# EAGLE design acmon_interface (EAGLE 7.2.0)
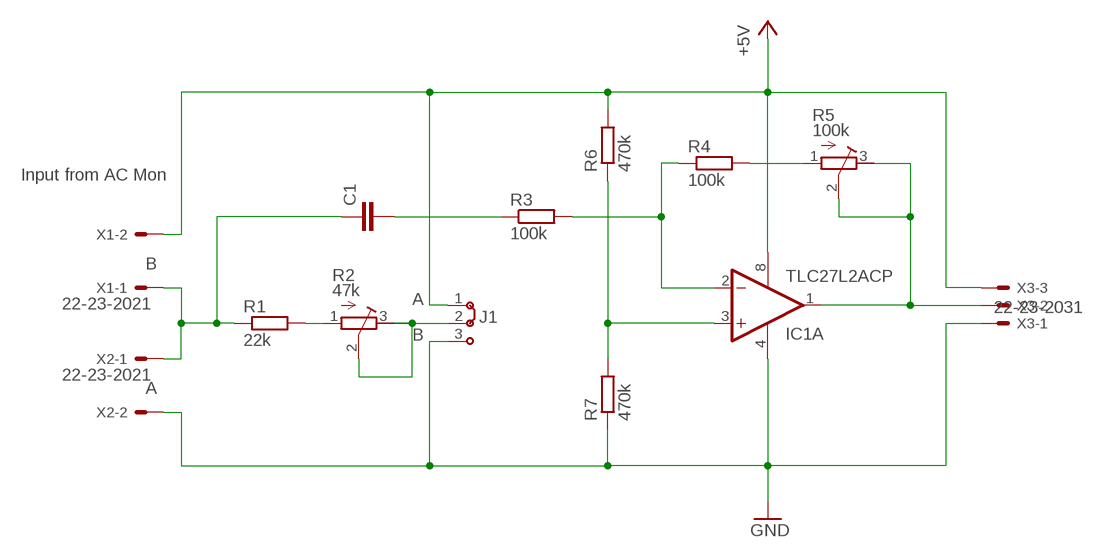
[diagram p0: schematic, sheet 1]

## Parts
C1  C-EU050-030X075  [C050-030X075]
IC1  TLC27L2ACP  [DIL08]
J1  J2X2MM  [04C]
R1  22k  R-EU_0207/10  [0207/10]
R2  47k  R-TRIMM64Y  [RTRIM64Y]
R3  100k  R-EU_0207/10  [0207/10]
R4  100k  R-EU_0207/10  [0207/10]
R5  100k  R-TRIMM64Y  [RTRIM64Y]
R6  470k  R-EU_0207/10  [0207/10]
R7  470k  R-EU_0207/10  [0207/10]
X1  22-23-2021  [22-23-2021]
X2  22-23-2021  [22-23-2021]
X3  22-23-2031  [22-23-2031]

## Nets
+5V: IC1.8(C:VDD) J1.1 R6.2 X1.2 X3.3
GND: IC1.4(C:GND) J1.3 R7.1 X2.2 X3.1
N$1: J1.2 R2.2(S) R2.3(E)
N$2: R1.2 R2.1(A)
N$3: C1.1 R1.1 X1.1 X2.1
N$6: IC1.2(A:-IN) R3.2 R4.1
N$7: R4.2 R5.1(A)
N$8: IC1.1(A:OUT) R5.2(S) R5.3(E) X3.2
N$9: C1.2 R3.1
N$10: IC1.3(A:+IN) R6.1 R7.2
Unconnected: IC1.5(B:+IN) IC1.6(B:-IN) IC1.7(B:OUT)

## Notes on the sheet
- Input from AC Mon
- B
- A
- B
- A

## Library data of the parts
C1 = resistor:C-EU: CAPACITOR, European symbol
IC1 = linear:TLC27L*: LinCMOS(TM) PRECISION DUAL OPERATIONAL AMPLIFIERS Source: http://focus.ti.com/lit/ds/symlink/tlc27l2.pdf
J1 = jumper:J2: Jumper switch 2 x 2.5 mm
R1 R3 R4 R6 R7 = resistor:R-EU_: RESISTOR, European symbol
R2 R5 = resistor:R-TRIMM: Trimm resistor
X1 X2 = con-molex:22-23-2021: .100" (2.54mm) Center Header - 2 Pin; MF: MOLEX; MPN: 22-23-2021; OC_FARNELL: 1462926; OC_NEWARK: 25C3832
X3 = con-molex:22-23-2031: .100" (2.54mm) Center Header - 3 Pin; MF: MOLEX; MPN: 22-23-2031; OC_FARNELL: 1462950; OC_NEWARK: 30C0862

## Board
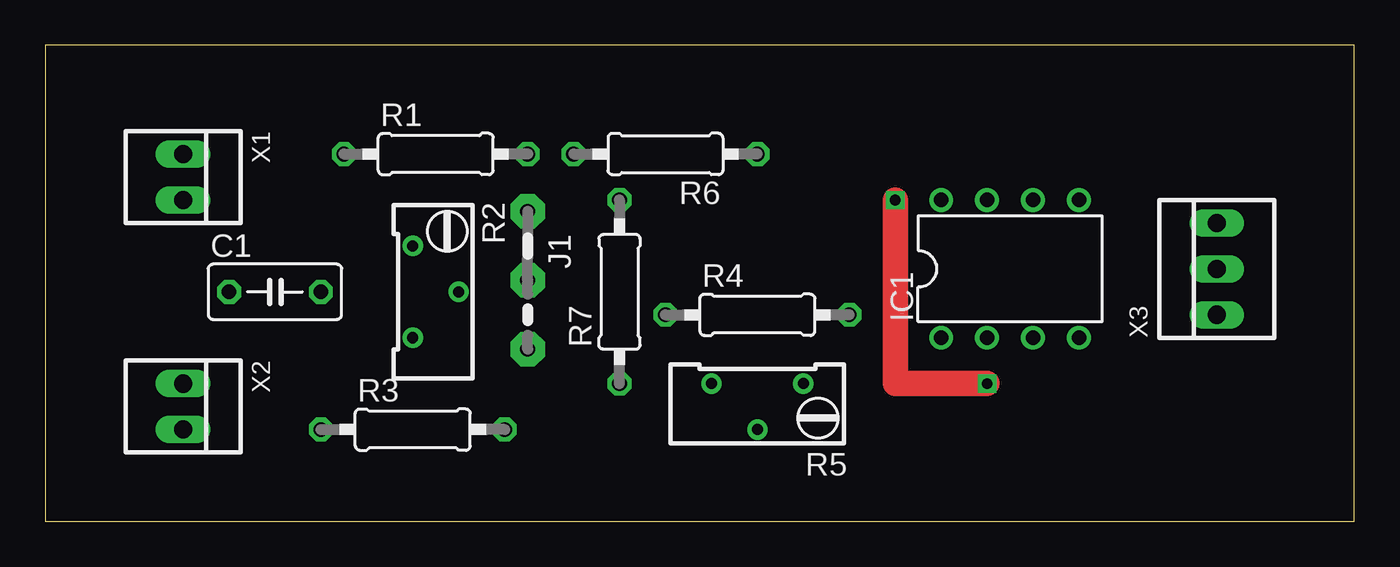
[diagram p1: board, top side]
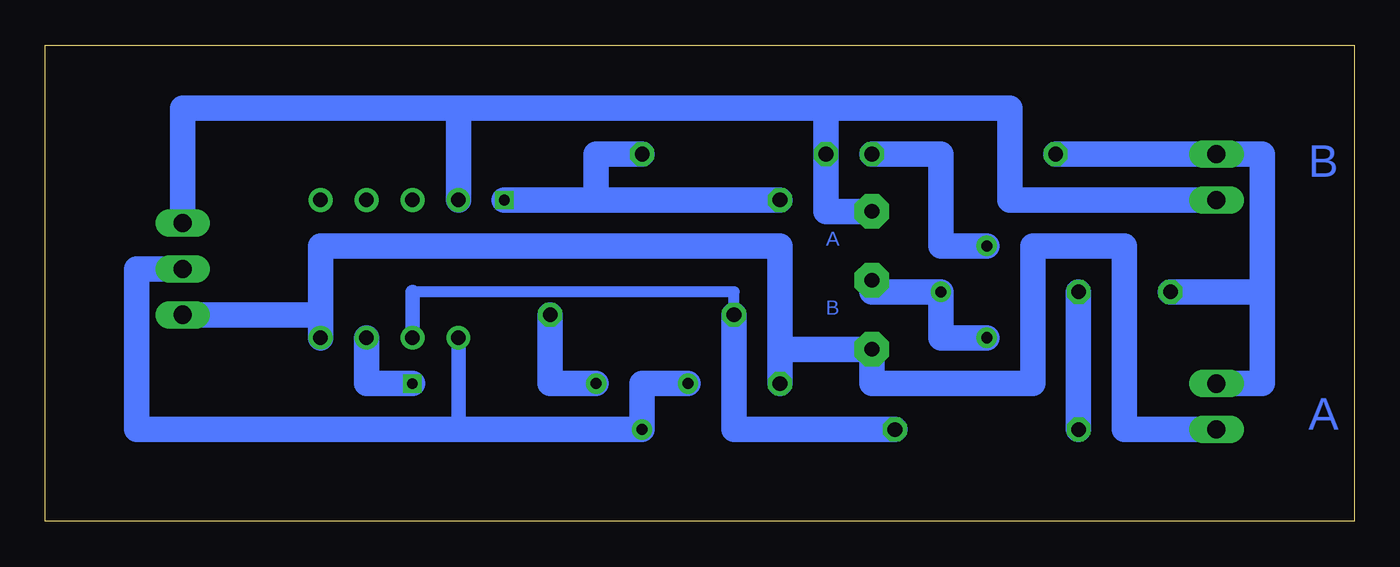
[diagram p2: board, bottom side, seen from below]

Size 72.37 x 26.34 mm. Coordinates in mm from the lower left corner, seen from the top.
Outline: 0,0 72.37,0 72.37,26.34 0,26.34 0,0
Copper layers (1*16): Top 0.035mm / dielectric 1.5mm / Bottom 0.035mm
Design rules "default": minimum track width 10mil, minimum drill 24mil, track to track 8mil, track to pad 8mil, pad to pad 8mil, via to via 8mil, smd to smd 8mil, copper to edge 40mil, drill to drill 8mil, minimum pad ring 10mil, minimum via ring 8mil, stop-mask expansion 4mil, vias tented up to drill 0mil, thermal gap 10mil

### Footprints (pad centres in the part's own frame; a part is rotated, then mirrored left to right if it is on the bottom)
C050-030X075 = drill 0.813 octagon: 1 -2.54,0; 2 2.54,0
DIL08 = drill 0.813 pad 1.27: 1 -3.81,-3.81; 2 -1.27,-3.81; 3 1.27,-3.81; 4 3.81,-3.81; 5 3.81,3.81; 6 1.27,3.81; 7 -1.27,3.81; 8 -3.81,3.81
04C = drill 0.813 pad 1.905 octagon: 1 -1.905,0; 2 1.905,0; 3 5.715,0
0207/10 = drill 0.813 octagon: 1 -5.08,0; 2 5.08,0
RTRIM64Y = drill 0.61: 1 0,-2.54; 2 -2.54,0; 3 0,2.54
22-23-2021 = drill 1 long: 1 -1.27,0; 2 1.27,0
22-23-2031 = drill 1 long: 1 -2.54,0; 2 0,0; 3 2.54,0

### Placement (x,y rotation side)
C1  12.7,12.7 0 top
IC1  53.34,13.97 0 top
J1  26.67,15.24 270 top
R1  21.59,20.32 0 top
R2  20.32,12.7 180 top
R3  20.32,5.08 0 top
R4  39.37,11.43 0 top
R5  39.37,7.62 90 top
R6  34.29,20.32 180 top
R7  31.75,12.7 90 top
X1  7.62,19.05 270 top
X2  7.62,6.35 270 top
X3  64.77,13.97 90 top

### Tracks (layer width: path | path; a pad name or v marks a point on that pad's centre or on a via)
+5V
  Bottom 1.422: J1.1 29.21,17.15 R6.2 29.21,22.86 | X1.2 19.05,17.78 19.05,22.86 29.21,22.86 | 29.21,22.86 49.53,22.86 | 49.53,22.86 IC1.8 | X3.3 64.77,22.86 49.53,22.86
GND
  Bottom 1.422: X3.1 57.15,11.43 IC1.4 57.15,15.24 31.75,15.24 31.75,9.52 | X2.2 12.7,5.08 12.7,15.24 17.78,15.24 17.78,7.62 26.67,7.62 J1.3 31.75,9.52 | 31.75,9.52 R7.1
N$1
  Bottom 1.422: R2.3 22.86,10.16 R2.2 26.67,12.7 J1.2
N$2
  Bottom 1.422: R1.2 22.86,20.32 22.86,15.24 R2.1
N$3
  Bottom 1.422: C1.1 5.08,12.7 | 5.08,12.7 5.08,20.32 X1.1 R1.1 | X2.1 5.08,7.62 5.08,12.7
N$6
  Bottom 0.61: R4.1 34.29,12.7 52.07,12.7
  Bottom 0.813: 52.07,12.7 IC1.2
  Bottom 1.422: R3.2 34.29,5.08 R4.1
N$7
  Bottom 1.422: R4.2 44.45,7.62 R5.1
N$8
  Bottom 0.813: IC1.1 49.53,5.08 R5.2
  Bottom 1.422: R5.3 39.37,7.62 R5.2 67.31,5.08 67.31,13.97 X3.2
N$9
  Bottom 1.422: C1.2 R3.1
N$10  (via drill 0.6)
  Top 1.422: v52.07,7.62 46.99,7.62 v46.99,17.78
  Bottom 1.422: R6.1 41.91,20.32 41.91,17.78 | IC1.3 54.61,7.62 v52.07,7.62 | v46.99,17.78 41.91,17.78 | R7.2 41.91,17.78

### Text on the board
Bottom: B | A | B | A